# EAGLE design buttons (EAGLE 7.6.0)
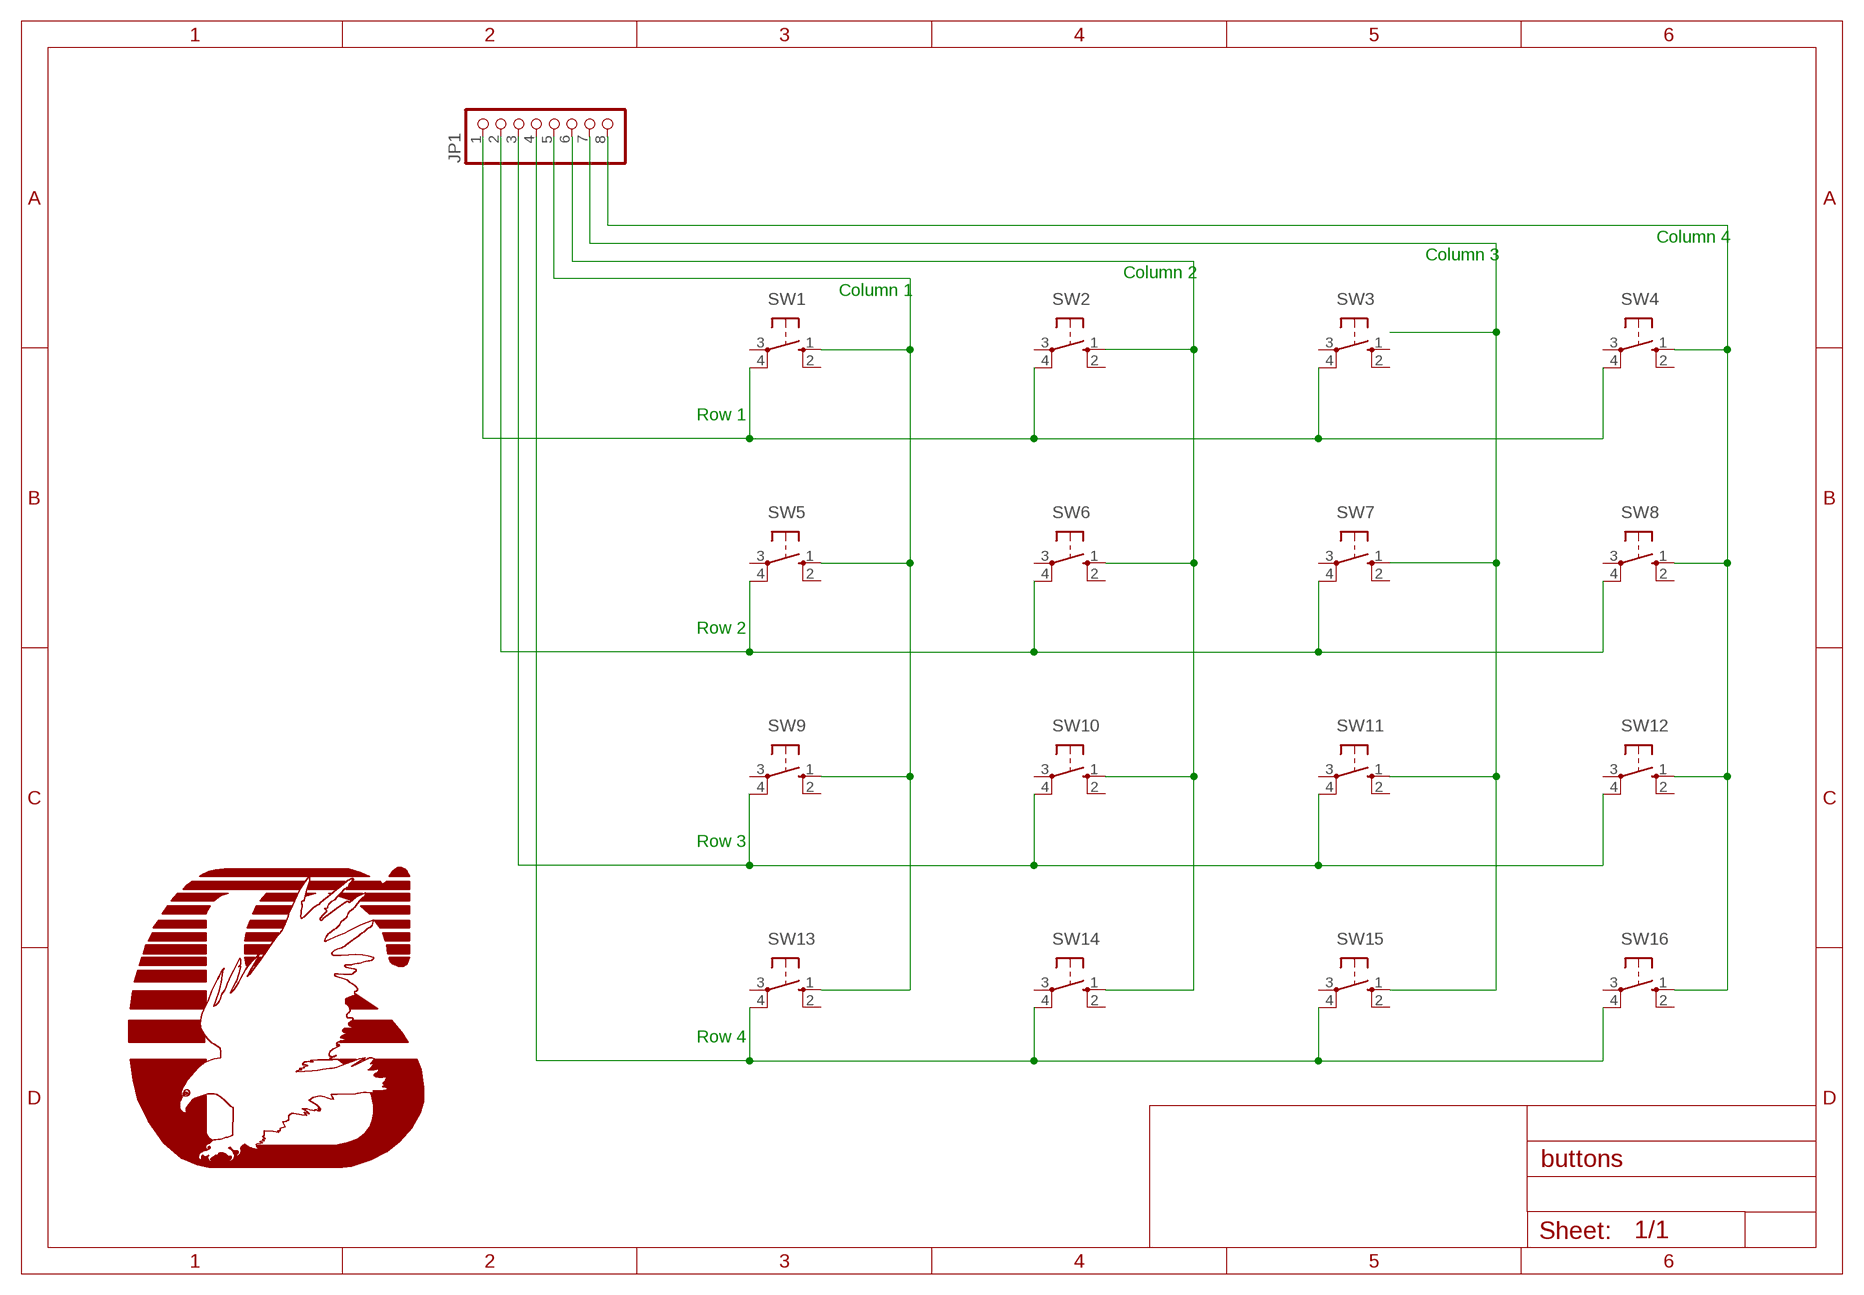
[diagram p0: schematic, sheet 1]

## Parts
JP1  PINHD-1X8-3.5MM  [1X08-3.5MM]
SW1  10-XX  [B3F-10XX]
SW2  10-XX  [B3F-10XX]
SW3  10-XX  [B3F-10XX]
SW4  10-XX  [B3F-10XX]
SW5  10-XX  [B3F-10XX]
SW6  10-XX  [B3F-10XX]
SW7  10-XX  [B3F-10XX]
SW8  10-XX  [B3F-10XX]
SW9  10-XX  [B3F-10XX]
SW10  10-XX  [B3F-10XX]
SW11  10-XX  [B3F-10XX]
SW12  10-XX  [B3F-10XX]
SW13  10-XX  [B3F-10XX]
SW14  10-XX  [B3F-10XX]
SW15  10-XX  [B3F-10XX]
SW16  10-XX  [B3F-10XX]

## Nets
N$1: JP1.1 SW1.4(P1) SW2.4(P1) SW3.4(P1) SW4.4(P1)
N$2: JP1.2 SW5.4(P1) SW6.4(P1) SW7.4(P1) SW8.4(P1)
N$3: JP1.3 SW9.4(P1) SW10.4(P1) SW11.4(P1) SW12.4(P1)
N$4: JP1.4 SW13.4(P1) SW14.4(P1) SW15.4(P1) SW16.4(P1)
N$5: JP1.5 SW1.1(S) SW5.1(S) SW9.1(S) SW13.1(S)
N$6: JP1.6 SW2.1(S) SW6.1(S) SW10.1(S) SW14.1(S)
N$7: JP1.7 SW7.1(S) SW11.1(S) SW15.1(S)
N$8: JP1.8 SW4.1(S) SW8.1(S) SW12.1(S) SW16.1(S)
Unconnected: SW1.2(S1) SW1.3(P) SW2.2(S1) SW2.3(P) SW3.1(S) SW3.2(S1) SW3.3(P) SW4.2(S1) SW4.3(P) SW5.2(S1) SW5.3(P) SW6.2(S1) SW6.3(P) SW7.2(S1) SW7.3(P) SW8.2(S1) SW8.3(P) SW9.2(S1) SW9.3(P) SW10.2(S1) SW10.3(P) SW11.2(S1) SW11.3(P) SW12.2(S1) SW12.3(P) SW13.2(S1) SW13.3(P) SW14.2(S1) SW14.3(P) SW15.2(S1) SW15.3(P) SW16.2(S1) SW16.3(P)

## Notes on the sheet
- Column 4
- Column 3
- Column 2
- Column 1
- Row 1
- Row 2
- Row 3
- Row 4

## Library data of the parts
JP1 = adafruit:PINHD-1X8: PIN HEADER
SW1-SW16 = buttons:10-XX: OMRON SWITCH

## Board
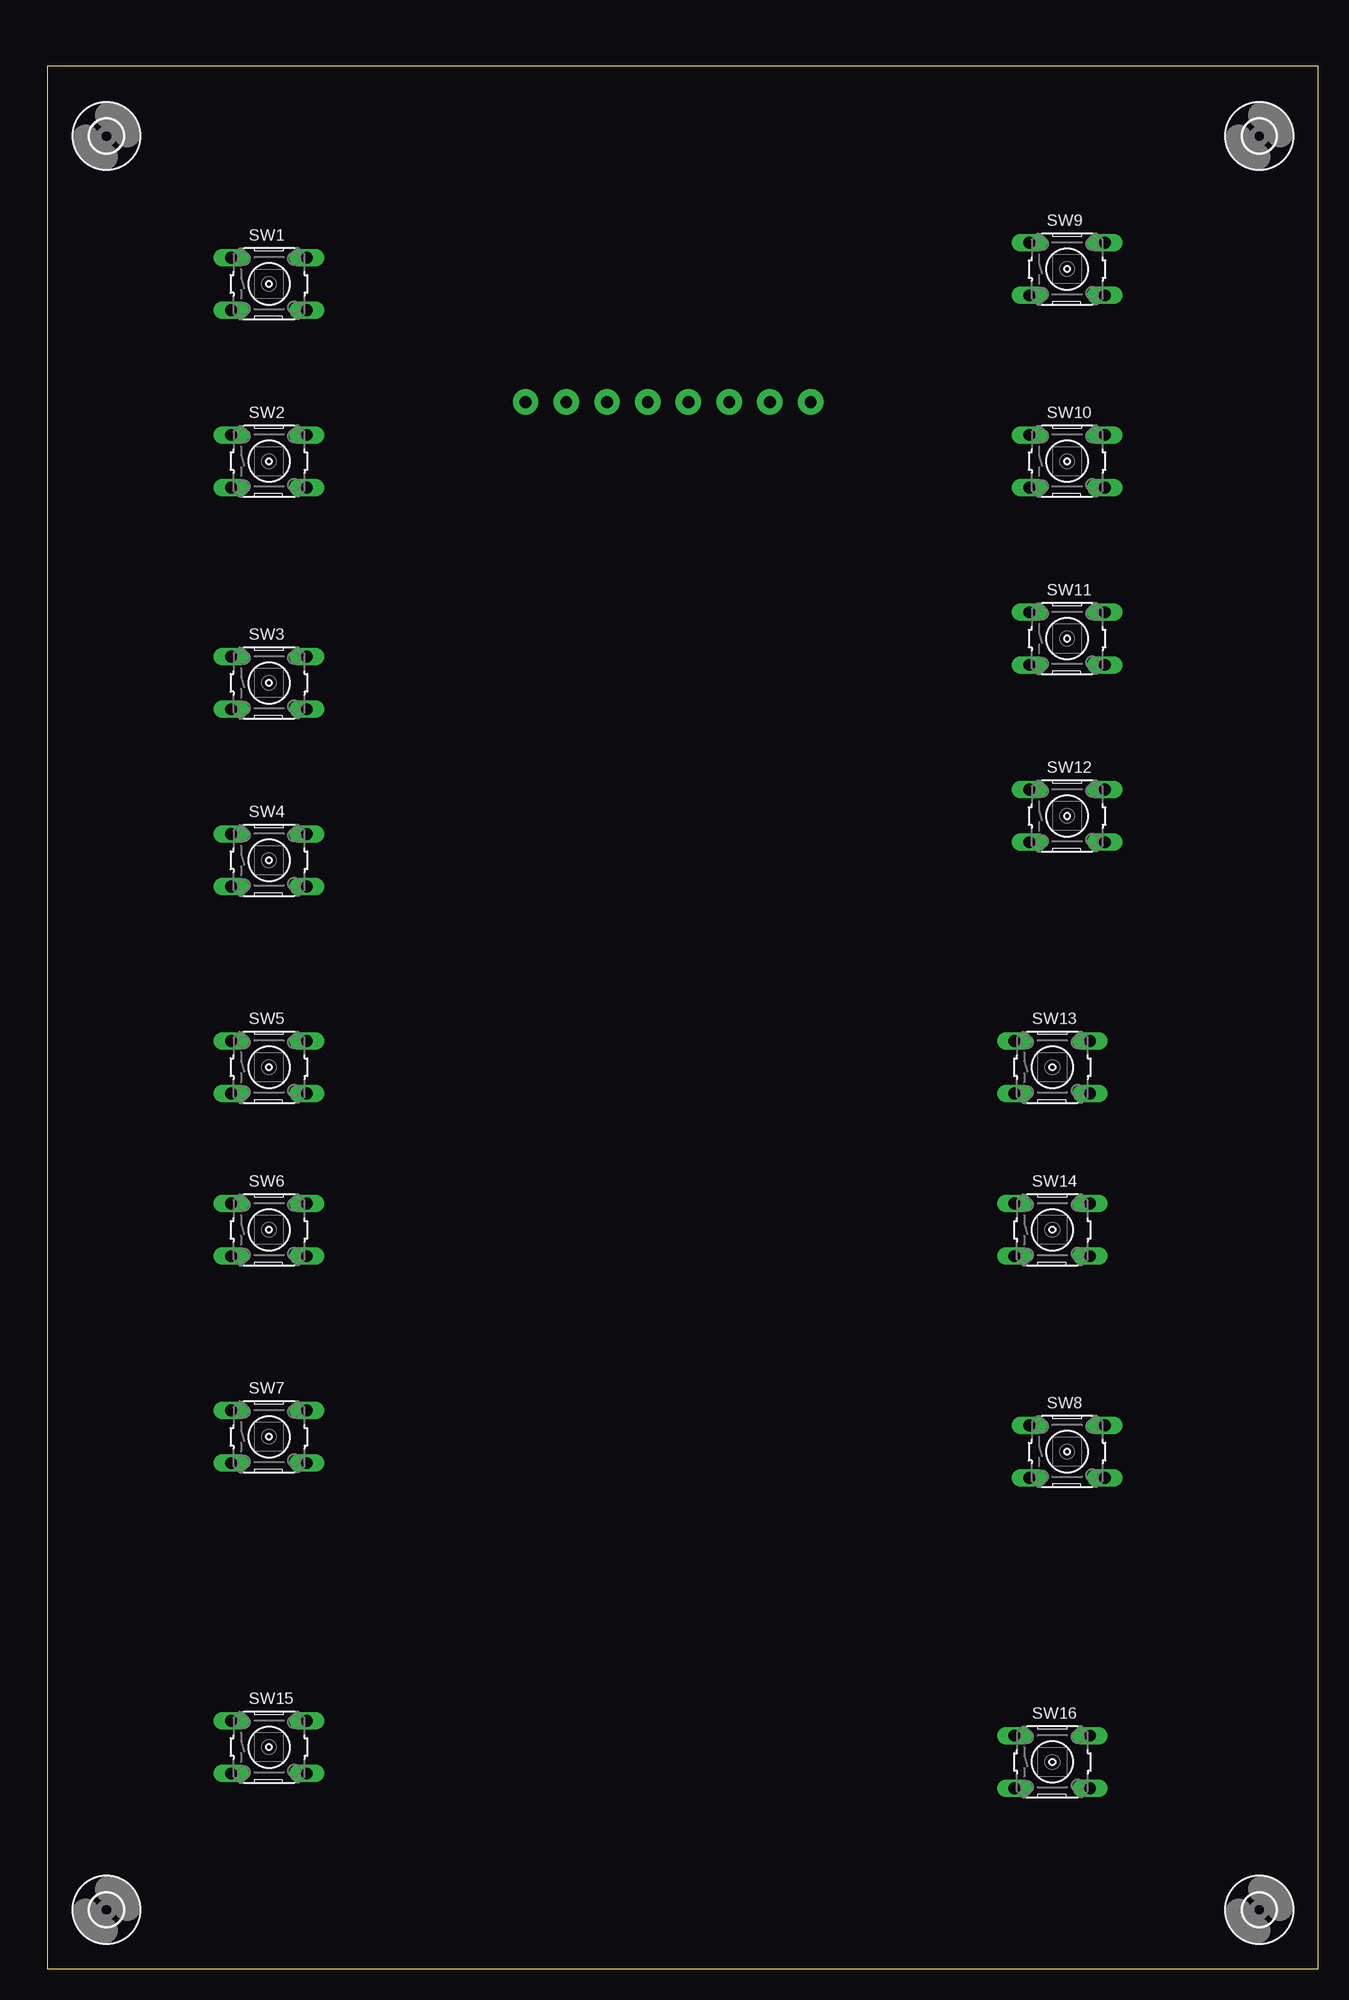
[diagram p1: board, top side]
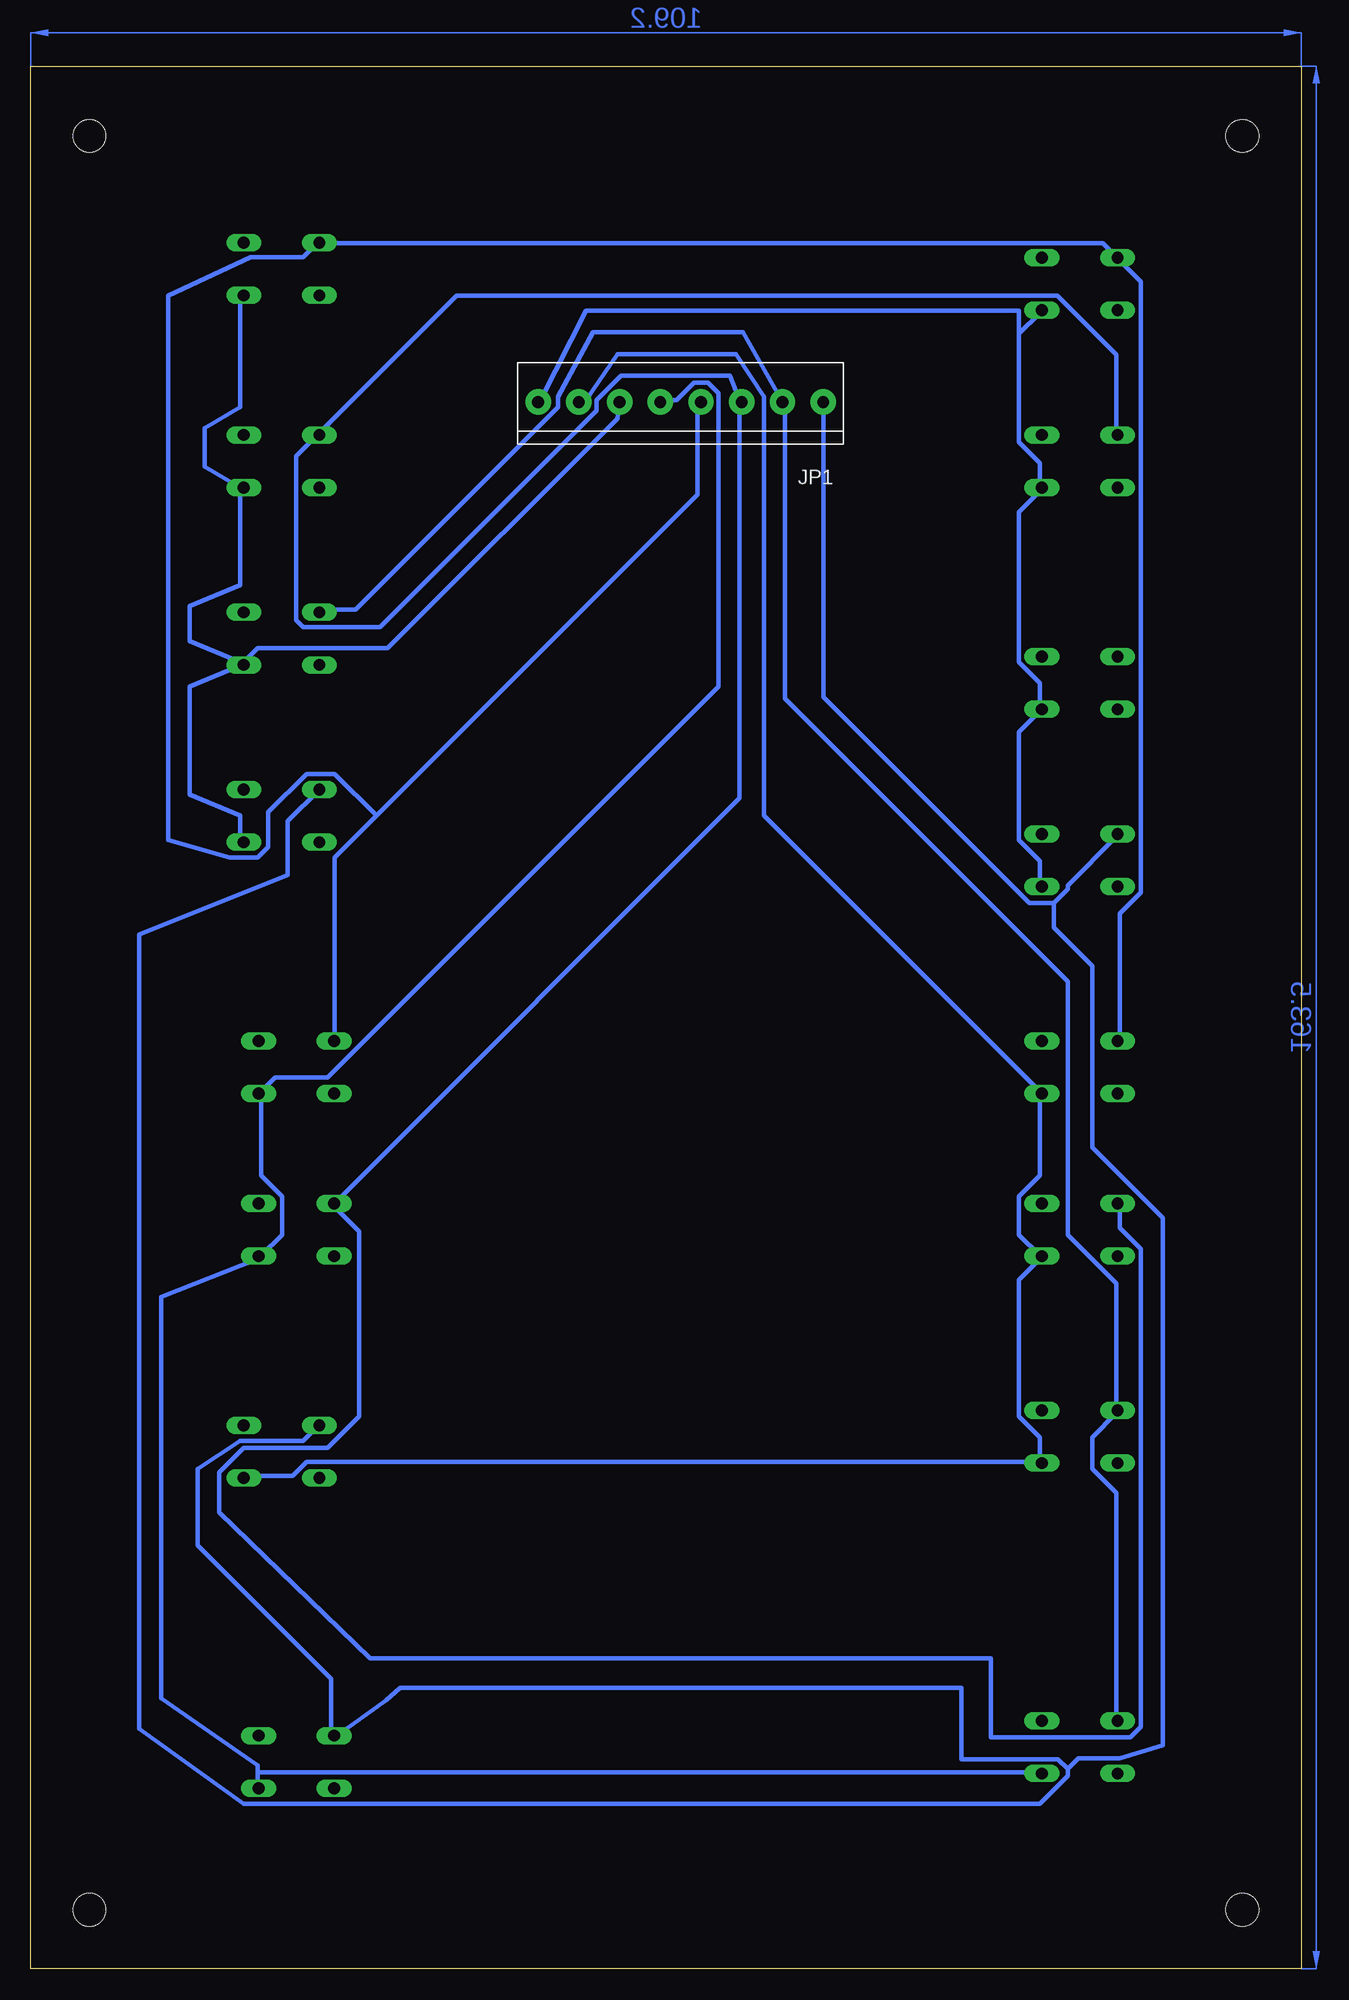
[diagram p2: board, bottom side, seen from below]

Size 109.2 x 163.5 mm. Coordinates in mm from the lower left corner, seen from the top.
Outline: 0,0 109.2,0 109.2,163.5 0,163.5 0,0
Copper layers (1*16): Top 0.035mm / dielectric 1.5mm / Bottom 0.035mm
Design rules "default *": minimum track width 0.4mm, minimum drill 24mil, track to track 0.2mm, track to pad 0.2mm, pad to pad 0.2mm, via to via 0.2mm, smd to smd 0.2mm, copper to edge 40mil, drill to drill 8mil, minimum pad ring 10mil, minimum via ring 8mil, stop-mask expansion 4mil, vias tented up to drill 0mil, thermal gap 10mil

### Footprints (pad centres in the part's own frame; a part is rotated, then mirrored left to right if it is on the bottom)
1X08-3.5MM = drill 1 pad 2.184: 1 -12.25,0; 2 -8.75,0; 3 -5.25,0; 4 -1.75,0; 5 1.75,0; 6 5.25,0; 7 8.75,0; 8 12.25,0
B3F-10XX = drill 1.016 long: 1 -3.251,2.261; 2 3.251,2.261; 3 -3.251,-2.261; 4 3.251,-2.261
2,8 = hole 2.8: 0,0

### Placement (x,y rotation side)
JP1  53.34,134.62 0 bottom
SW1  19.05,144.78 0 top
SW2  19.05,129.54 0 top
SW3  19.05,110.49 0 top
SW4  19.05,95.25 0 top
SW5  19.05,77.47 0 top
SW6  19.05,63.5 0 top
SW7  19.05,45.72 0 top
SW8  87.63,44.45 0 top
SW9  87.63,146.05 0 top
SW10  87.63,129.54 0 top
SW11  87.63,114.3 0 top
SW12  87.63,99.06 0 top
SW13  86.36,77.47 0 top
SW14  86.36,63.5 0 top
SW15  19.05,19.05 0 top
SW16  86.36,17.78 0 top
U$1  [2,8]  5.08,157.48 0 top
U$2  [2,8]  104.14,157.48 0 top
U$3  [2,8]  5.08,5.08 0 top
U$4  [2,8]  104.14,5.08 0 top

### Tracks (layer width: path | path; a pad name or v marks a point on that pad's centre or on a via)
N$1
  Bottom 0.4: SW4.4 22.48,93.08 22.48,95.18 24.28,96.98 24.28,106.28 22.48,108.08 SW3.4 22.48,108.38 22.48,110.48 24.28,112.28 24.28,125.18 22.48,126.98 SW2.4 22.48,127.28 22.48,129.38 24.28,131.18 24.28,140.48 | 24.28,140.48 24.28,142.49 61.48,142.49 65.38,134.78 JP1.1 | 24.28,140.48 22.48,142.28 SW1.4
N$2
  Bottom 0.4: 22.48,43.58 22.48,45.68 24.28,47.48 24.28,59.18 22.48,60.98 SW6.4 22.48,61.28 24.28,63.08 24.28,66.38 22.48,68.18 22.48,75.08 SW5.4 22.48,75.38 46.18,99.08 46.18,135.08 48.58,138.75 58.78,138.75 61.48,134.78 62.08,134.78 JP1.2 | 22.48,43.58 85.48,43.58 86.68,42.38 90.88,42.38 SW8.4 | 22.48,43.58 SW7.4
N$3
  Bottom 0.4: SW12.4 91.18,96.98 91.18,99.08 95.52,100.88 95.52,110.18 91.18,111.98 SW11.4 | SW11.4 91.18,112.28 95.52,114.08 95.52,117.08 91.18,118.88 91.18,126.98 SW10.4 91.18,127.28 94.25,129.08 94.25,132.38 91.18,134.18 91.18,143.78 SW9.4 | JP1.3 58.78,133.21 78.51,113.48 89.68,113.48 90.88,112.28 SW11.4
N$4
  Bottom 0.4: 89.68,16.88 89.68,17.48 97.99,23.25 97.99,57.75 89.68,60.98 SW14.4 89.38,61.28 87.58,63.08 87.58,66.38 89.38,68.18 89.38,75.08 SW13.4 89.38,75.38 88.18,76.58 83.68,76.58 50.08,110.18 50.08,135.38 50.98,136.28 52.18,136.28 53.68,134.78 54.88,134.78 JP1.4 | 89.68,16.88 89.68,15.68 SW16.4 | 89.68,16.88 22.48,16.88 SW15.4
N$5
  Bottom 0.4: 79.48,99.08 51.88,126.68 51.88,134.48 JP1.5 | 79.48,99.08 83.08,95.48 83.08,79.88 SW13.1 | SW5.1 15.58,79.88 15.58,90.68 13.78,92.48 13.78,144.98 15.58,146.78 SW1.1 15.88,147.08 17.08,148.28 84.28,148.28 SW9.1 84.58,148.28 85.78,147.08 90.28,147.08 97.39,143.78 97.39,96.98 92.08,95.48 89.68,95.48 88.78,96.38 88.78,99.38 85.48,102.68 83.08,102.68 79.48,99.08
N$6
  Bottom 0.4: SW2.1 15.88,132.08 15.88,138.68 20.98,143.78 72.58,143.78 84.28,132.08 SW10.1 84.58,131.78 86.38,129.98 86.38,115.88 85.78,115.28 79.18,115.28 60.58,133.88 60.58,134.78 58.48,136.88 49.11,136.88 48.28,134.78 JP1.6 48.28,134.48 48.28,100.58 83.08,65.78 SW14.1 83.08,65.48 80.98,63.38 80.98,47.48 83.68,44.78 90.88,44.78 92.98,42.68 92.98,39.24 80.01,26.67 26.67,26.67 26.67,19.88 14.68,19.88 13.78,20.78 13.78,61.88 15.58,63.68 15.58,65.48 SW6.1
N$7
  Bottom 0.4: SW15.1 15.88,21.38 15.88,40.88 17.98,42.98 17.98,45.68 15.88,47.78 SW7.1 15.88,48.08 15.88,58.88 20.08,63.08 20.08,84.84 44.38,109.14 44.38,134.48 JP1.7 44.68,134.78 47.98,140.62 60.88,140.62 63.88,135.08 63.88,134.18 81.28,116.78 84.28,116.78 SW11.1
N$8
  Bottom 0.4: 21.28,91.58 20.08,92.78 20.08,93.08 15.88,97.28 SW4.1 | 21.28,91.58 23.38,91.58 41.08,109.28 41.08,134.48 JP1.8 | SW8.1 84.58,46.58 85.78,45.38 91.18,45.38 94.85,42.98 94.85,36.4 83.38,24.93 83.38,20.18 SW16.1 83.08,19.88 78.67,23.09 77.47,24.13 29.21,24.13 29.21,18.01 20.91,18.01 20.08,17.18 | 20.08,17.18 20.08,16.58 22.48,14.18 90.88,14.18 99.86,20.62 99.86,88.88 87.12,94 87.12,98.64 SW12.1 | 21.28,91.58 21.28,89.48 17.98,86.18 17.98,70.58 11.91,64.51 11.91,19.21 15.58,18.08 19.18,18.08 20.08,17.18
(copper drawn outside any net)
  shapes: Bottom area x2